# EAGLE design display-bar (EAGLE 9.1.0)
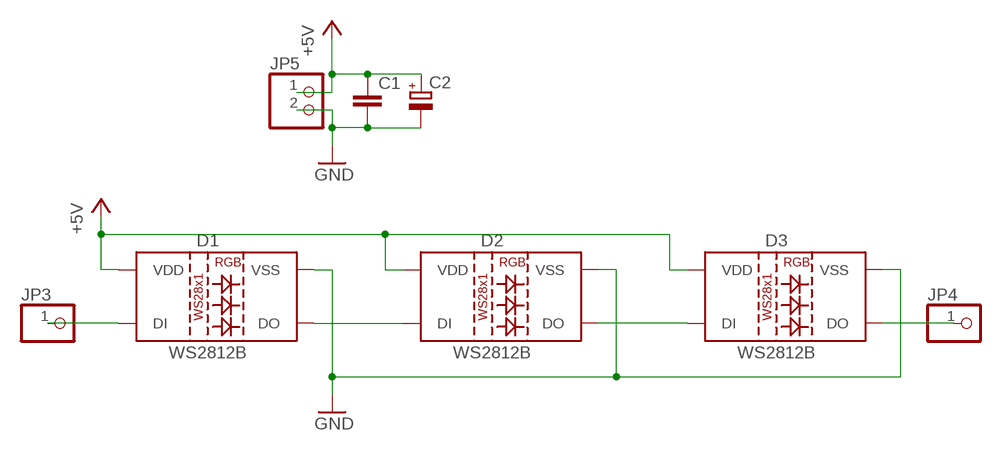
[diagram p0: schematic, sheet 1]

## Parts
C1  C-EUC1206  [C1206]
C2  CPOL-EUE2.5-6  [E2,5-6]
D1  WS2812B  [WS2812B]
D2  WS2812B  [WS2812B]
D3  WS2812B  [WS2812B]
JP3  PINHD-1X1  [1X01]
JP4  PINHD-1X1  [1X01]
JP5  PINHD-1X2  [1X02]

## Nets
+5V: C1.1 C2.+ D1.1(VDD) D2.1(VDD) D3.1(VDD) JP5.1
GND: C1.2 C2.- D1.3(VSS) D2.3(VSS) D3.3(VSS) JP5.2
N$1: D3.2(DO) JP4.1
N$2: D2.2(DO) D3.4(DI)
N$3: D1.2(DO) D2.4(DI)
N$15: D1.4(DI) JP3.1

## Library data of the parts
C1 = rcl:C-EU: CAPACITOR, European symbol; SPICEPREFIX: C
C2 = rcl:CPOL-EU: POLARIZED CAPACITOR, European symbol; SPICEPREFIX: C
D1-D3 = WS2812B:WS2812B: WS2812B SMD addressable RGB LED 5x5mm SMD LED with built-in controller IC. Color: Red/Green/Blue mC Rating: RGB: 390, 660, 180 mcd Forward Voltage: RGB: 2.0, 3.0, 3.0 V Packages:WS2812B SparkFun Products: Blynk Board - ESP8266 <https://www.sparkfun.com/products/13794>; AVAILABILITY: Unavailable; DESCRIPTION: Intelligent Control Led Integrated Light Source Pack Of 10; MF: Worldsemi; MP: WS2812B; PACKAGE: None; PRICE: None
JP3 JP4 = pinhead:PINHD-1X1: PIN HEADER
JP5 = pinhead:PINHD-1X2: PIN HEADER

## Board
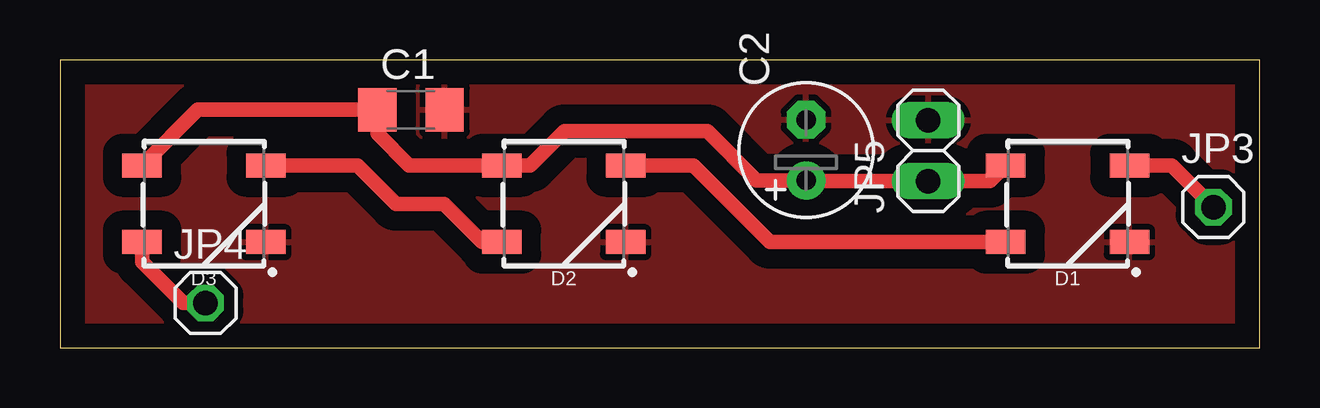
[diagram p1: board, top side]

Size 50 x 12 mm. Coordinates in mm from the lower left corner, seen from the top.
Outline: 50,0 50,12 0,12 0,0 50,0
Copper layers (1*16): Top 0.035mm / dielectric 1.5mm / Bottom 0.035mm
Design rules "default *": minimum track width 6mil, minimum drill 0.35mm, track to track 32mil, track to pad 16mil, pad to pad 24mil, via to via 6mil, smd to smd 6mil, copper to edge 40mil, drill to drill 6mil, minimum pad ring 10mil, minimum via ring 8mil, stop-mask expansion 4mil, vias tented up to drill 0mil, thermal gap 10mil

### Footprints (pad centres in the part's own frame; a part is rotated, then mirrored left to right if it is on the bottom)
C1206 = smd 1.6 x 1.8: 1 -1.4,0; 2 1.4,0
E2,5-6 = drill 0.813 pad 1.6: + -1.27,0 | drill 0.813 pad 1.6 octagon: - 1.27,0
WS2812B = smd 1.651 x 1: 1 2.577,-1.6; 2 2.577,1.6; 3 -2.577,1.6; 4 -2.577,-1.6
1X01 = drill 1.016 octagon: 1 0,0
1X02 = drill 1.016 long: 1 -1.27,0; 2 1.27,0

### Placement (x,y rotation side)
C1  14.63,9.92 0 top
C2  31.1,8.24 90 top
D1  42,6 180 top
D2  21,6 180 top
D3  6,6 180 top
JP3  48.08,5.86 0 top
JP4  6.07,1.86 0 top
JP5  36.19,8.21 90 top

### Tracks (layer width: path | path; a pad name or v marks a point on that pad's centre or on a via)
+5V
  Top 0.61: 7,9.92 C1.1 13.23,8.92 14.55,7.6 16.23,7.6 D2.1 19.6,7.6 21.02,9.02 26.99,9.02 29.04,6.97 C2.+ 31.13,6.94 JP5.1 38.76,6.94 D1.1 | 7,9.92 6.32,9.92 | 7,9.92 5.74,9.92 D3.1
GND
  pour Top: 0,0 49.97,0 49.97,12 0,12
N$1
  Top 0.61: JP4.1 5.14,1.86 3.42,3.58 D3.2
N$2
  Top 0.61: D3.4 12.4,7.6 14,6 16,6 17.6,4.4 D2.2
N$3
  Top 0.61: D2.4 26.4,7.6 29.6,4.4 D1.2
N$15
  Top 0.61: JP3.1 46.34,7.6 D1.4